# Altium schematic sheet BalEv_AINb_v1_0.SchDoc
size A3; CompanyName: HESSO; Address1: Route du Rawyl 47; Address2: 1950 Sion; Address3: Switzerland; DocumentNumber: 3; SheetNumber: 7; SheetTotal: 8; PageSetup: Record=PageOptions|CenterHorizontal=True|CenterVertical=True|PrintScale=1.00|XCorrection=1.00|YCorrection=1.00|PrintKind=1|BorderSize=5000000|LeftOffset=0|BottomOffset=0|Orientation=2|PaperLength=1000|PaperWidth=1000|Scale=100|PaperSource=15|PrintQuality=1200|MediaType=1|DitherType=10|PrintScaleMode=1|PaperKind=A4|PaperIndex=9; ProjectName: Project Name
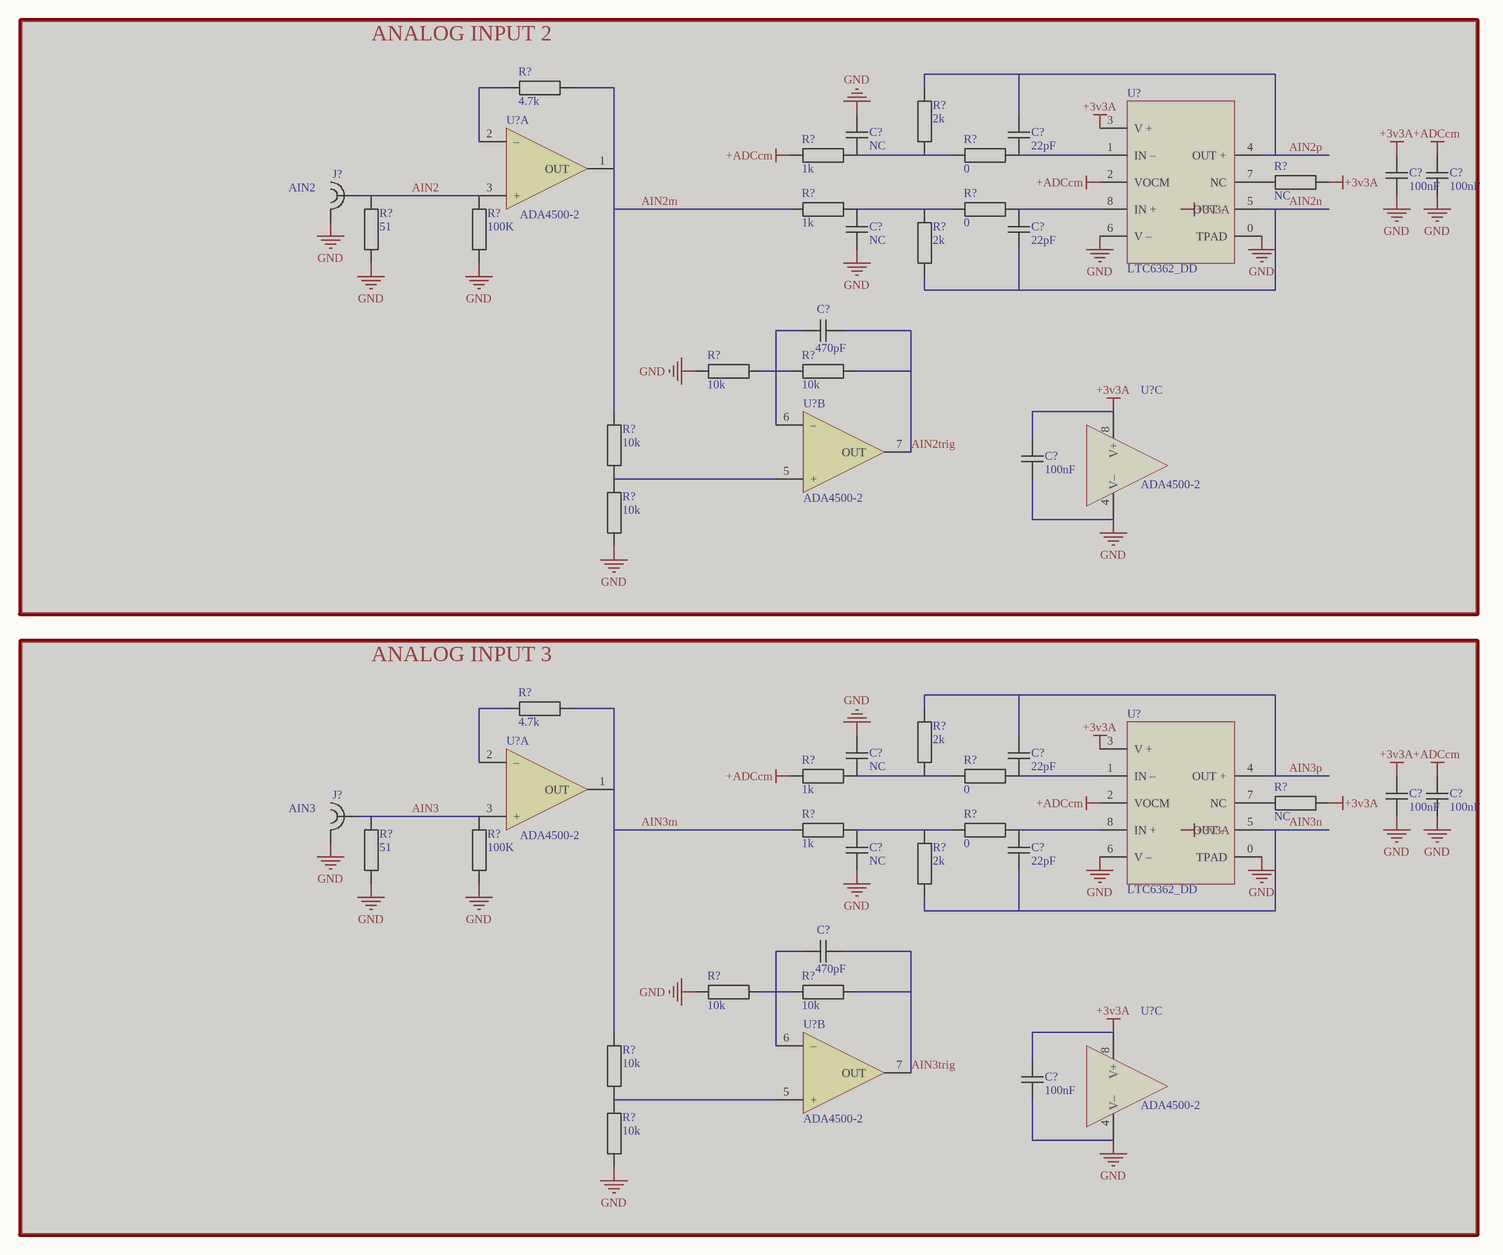
[diagram p0: BalEv_AINb_v1_0.SchDoc]

## Parts
(Parts that share a designator on the sheet are numbered #1, #2 ... from top to bottom, then left to right.)
C?#1  NC  [CAPACITOR 1005 REFLOW]  (masked out: inside a compile mask, not in the netlist)
C?#2  22pF  [CAPACITOR 1005 REFLOW]  (masked out: inside a compile mask, not in the netlist)
C?#3  100nF  [CAPACITOR 1005 REFLOW]  (masked out: inside a compile mask, not in the netlist)
C?#4  100nF  [CAPACITOR 1005 REFLOW]  (masked out: inside a compile mask, not in the netlist)
C?#5  NC  [CAPACITOR 1005 REFLOW]  (masked out: inside a compile mask, not in the netlist)
C?#6  22pF  [CAPACITOR 1005 REFLOW]  (masked out: inside a compile mask, not in the netlist)
C?#7  470pF  [CAPACITOR 1005 REFLOW]  (masked out: inside a compile mask, not in the netlist)
C?#8  100nF  [CAPACITOR 1005 REFLOW]  (masked out: inside a compile mask, not in the netlist)
C?#9  NC  [CAPACITOR 1005 REFLOW]  (masked out: inside a compile mask, not in the netlist)
C?#10  22pF  [CAPACITOR 1005 REFLOW]  (masked out: inside a compile mask, not in the netlist)
C?#11  100nF  [CAPACITOR 1005 REFLOW]  (masked out: inside a compile mask, not in the netlist)
C?#12  100nF  [CAPACITOR 1005 REFLOW]  (masked out: inside a compile mask, not in the netlist)
C?#13  NC  [CAPACITOR 1005 REFLOW]  (masked out: inside a compile mask, not in the netlist)
C?#14  22pF  [CAPACITOR 1005 REFLOW]  (masked out: inside a compile mask, not in the netlist)
C?#15  470pF  [CAPACITOR 1005 REFLOW]  (masked out: inside a compile mask, not in the netlist)
C?#16  100nF  [CAPACITOR 1005 REFLOW]  (masked out: inside a compile mask, not in the netlist)
J?#1  AIN2  [SMA EDGE Molex 732511150]  (masked out: inside a compile mask, not in the netlist)
J?#2  AIN3  [SMA EDGE Molex 732511150]  (masked out: inside a compile mask, not in the netlist)
R?#1  4.7k  [RESISTOR 1005 REFLOW]  (masked out: inside a compile mask, not in the netlist)
R?#2  1k  [RESISTOR 1005 REFLOW]  (masked out: inside a compile mask, not in the netlist)
R?#3  2k  [RESISTOR 1005 REFLOW]  (masked out: inside a compile mask, not in the netlist)
R?#4  0  [RESISTOR 1005 REFLOW]  (masked out: inside a compile mask, not in the netlist)
R?#5  NC  [RESISTOR 1005 REFLOW]  (masked out: inside a compile mask, not in the netlist)
R?#6  1k  [RESISTOR 1005 REFLOW]  (masked out: inside a compile mask, not in the netlist)
R?#7  2k  [RESISTOR 1005 REFLOW]  (masked out: inside a compile mask, not in the netlist)
R?#8  0  [RESISTOR 1005 REFLOW]  (masked out: inside a compile mask, not in the netlist)
R?#9  51  [RESISTOR 1005 REFLOW]  (masked out: inside a compile mask, not in the netlist)
R?#10  100K  [RESISTOR 1005 REFLOW]  (masked out: inside a compile mask, not in the netlist)
R?#11  10k  [RESISTOR 1005 REFLOW]  (masked out: inside a compile mask, not in the netlist)
R?#12  10k  [RESISTOR 1005 REFLOW]  (masked out: inside a compile mask, not in the netlist)
R?#13  10k  [RESISTOR 1005 REFLOW]  (masked out: inside a compile mask, not in the netlist)
R?#14  10k  [RESISTOR 1005 REFLOW]  (masked out: inside a compile mask, not in the netlist)
R?#15  4.7k  [RESISTOR 1005 REFLOW]  (masked out: inside a compile mask, not in the netlist)
R?#16  1k  [RESISTOR 1005 REFLOW]  (masked out: inside a compile mask, not in the netlist)
R?#17  2k  [RESISTOR 1005 REFLOW]  (masked out: inside a compile mask, not in the netlist)
R?#18  0  [RESISTOR 1005 REFLOW]  (masked out: inside a compile mask, not in the netlist)
R?#19  NC  [RESISTOR 1005 REFLOW]  (masked out: inside a compile mask, not in the netlist)
R?#20  1k  [RESISTOR 1005 REFLOW]  (masked out: inside a compile mask, not in the netlist)
R?#21  2k  [RESISTOR 1005 REFLOW]  (masked out: inside a compile mask, not in the netlist)
R?#22  0  [RESISTOR 1005 REFLOW]  (masked out: inside a compile mask, not in the netlist)
R?#23  51  [RESISTOR 1005 REFLOW]  (masked out: inside a compile mask, not in the netlist)
R?#24  100K  [RESISTOR 1005 REFLOW]  (masked out: inside a compile mask, not in the netlist)
R?#25  10k  [RESISTOR 1005 REFLOW]  (masked out: inside a compile mask, not in the netlist)
R?#26  10k  [RESISTOR 1005 REFLOW]  (masked out: inside a compile mask, not in the netlist)
R?#27  10k  [RESISTOR 1005 REFLOW]  (masked out: inside a compile mask, not in the netlist)
R?#28  10k  [RESISTOR 1005 REFLOW]  (masked out: inside a compile mask, not in the netlist)
U?#1  LTC6362_DD  [LFCSP8 P0.5 C3.0x2.8 H1.0]  (masked out: inside a compile mask, not in the netlist)
U?#2  ADA4500-2  [MSOP8 P0.65 C3.0X3.0 H1.1]  (part A of 3)  (masked out: inside a compile mask, not in the netlist)
U?#3  ADA4500-2  [MSOP8 P0.65 C3.0X3.0 H1.1]  (part C of 3)  (masked out: inside a compile mask, not in the netlist)
U?#4  ADA4500-2  [MSOP8 P0.65 C3.0X3.0 H1.1]  (part B of 3)  (masked out: inside a compile mask, not in the netlist)
U?#5  LTC6362_DD  [LFCSP8 P0.5 C3.0x2.8 H1.0]  (masked out: inside a compile mask, not in the netlist)
U?#6  ADA4500-2  [MSOP8 P0.65 C3.0X3.0 H1.1]  (part A of 3)  (masked out: inside a compile mask, not in the netlist)
U?#7  ADA4500-2  [MSOP8 P0.65 C3.0X3.0 H1.1]  (part C of 3)  (masked out: inside a compile mask, not in the netlist)
U?#8  ADA4500-2  [MSOP8 P0.65 C3.0X3.0 H1.1]  (part B of 3)  (masked out: inside a compile mask, not in the netlist)

## Blocks framed on the sheet
ANALOG INPUT 2: C?#1-C?#8 J?#1 R?#1-R?#14 U?#1-U?#4
ANALOG INPUT 3: C?#9-C?#16 J?#2 R?#15-R?#28 U?#5-U?#8

## Notes on the sheet
- Date :
- Revision :
- Sheet
- of
- Design by :

## Library data of the parts
C?#1-C?#16 = Capacitor
  C?#1 C?#5 C?#9 C?#13: Value: NC
  C?#2 C?#6 C?#10 C?#14: Value: 22pF
  C?#3 C?#4 C?#8 C?#11 C?#12 C?#16: Value: 100nF
  C?#7 C?#15: Value: 470pF
J?#1 J?#2 = SMA EDGE Molex 732511150
  J?#1: Value: AIN2
  J?#2: Value: AIN3
R?#1-R?#28 = Resistor
  R?#1 R?#15: Value: 4.7k
  R?#2 R?#6 R?#16 R?#20: Value: 1k
  R?#3 R?#7 R?#17 R?#21: Value: 2k
  R?#4 R?#8 R?#18 R?#22: Value: 0
  R?#5 R?#19: Value: NC
  R?#9 R?#23: Value: 51
  R?#10 R?#24: Value: 100K
  R?#11-R?#14 R?#25-R?#28: Value: 10k
U?#1 U?#5 = AD8139ACP: IC OPAMP DIFF 410MHZ RRO 8LFCSP; Value: LTC6362_DD
U?#2-U?#4 U?#6-U?#8 = OPA DUAL: Generic dual OPA 8 pins; Value: ADA4500-2